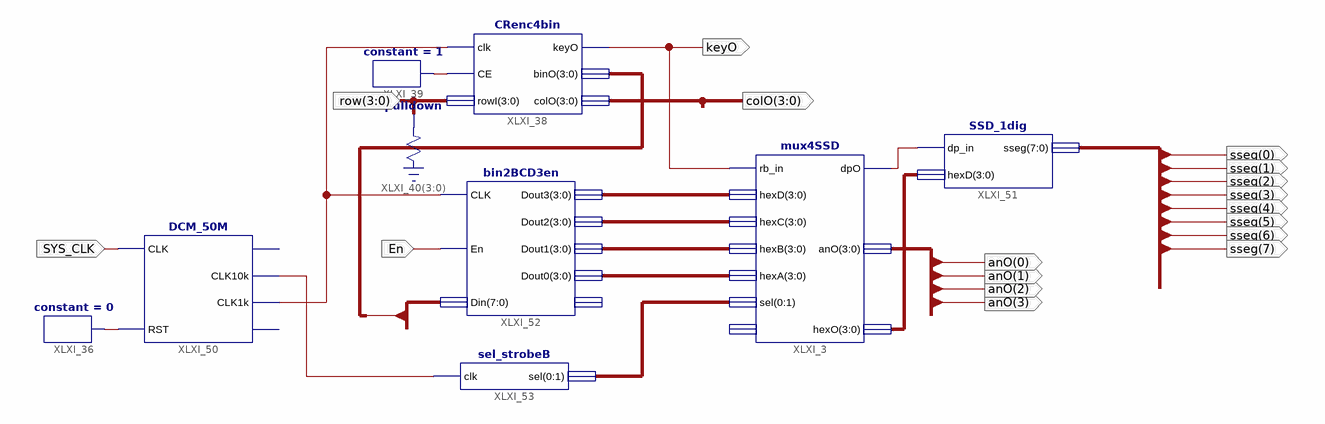
[diagram p0: schematic sheet 1]
// Xilinx ISE schematic Experiment4.sch (spartan3e) as structural Verilog: 9 symbols, 17 ports
module Experiment4 (
  input  [3:0] row,
  input  SYS_CLK,
  input  En,
  output [3:0] anO,
  output [7:0] sseg,
  output [3:0] colO,
  output keyO
);

  wire XLXN_181, XLXN_220, XLXN_242, XLXN_243, XLXN_261;
  wire [1:0] XLXN_239;
  wire [3:0] XLXN_185, XLXN_222, XLXN_223, XLXN_224, XLXN_225;
  wire [7:0] binO;

  SSD_1dig XLXI_51 (.dp_in(XLXN_181), .hexD(XLXN_185), .sseg(sseg));
  sel_strobeB XLXI_53 (.clk(XLXN_261), .sel({XLXN_239[0], XLXN_239[1]}));
  \pulldown  XLXI_40[3:0] (.O(row));
  bin2BCD3en XLXI_52 (
    .CLK(XLXN_243), .En(En), .Din(binO), .Dout3(XLXN_222), .Dout2(XLXN_223), .Dout1(XLXN_224),
    .Dout0(XLXN_225));  // open: RBout
  DCM_50M XLXI_50 (.CLK(SYS_CLK), .RST(XLXN_220), .CLK10k(XLXN_261), .CLK1k(XLXN_243));  // open: CLK1M, CLK1
  constant #(.CValue("1")) XLXI_39 (.O(XLXN_242));
  CRenc4bin XLXI_38 (.clk(XLXN_243), .CE(XLXN_242), .rowI(row), .keyO(keyO), .binO(binO[3:0]), .colO(colO));
  constant #(.CValue("0")) XLXI_36 (.O(XLXN_220));
  mux4SSD XLXI_3 (
    .rb_in(keyO), .hexD(XLXN_222), .hexC(XLXN_223), .hexB(XLXN_224), .hexA(XLXN_225),
    .sel({XLXN_239[0], XLXN_239[1]}), .dpO(XLXN_181), .anO(anO), .hexO(XLXN_185));  // open: dp_in
endmodule
